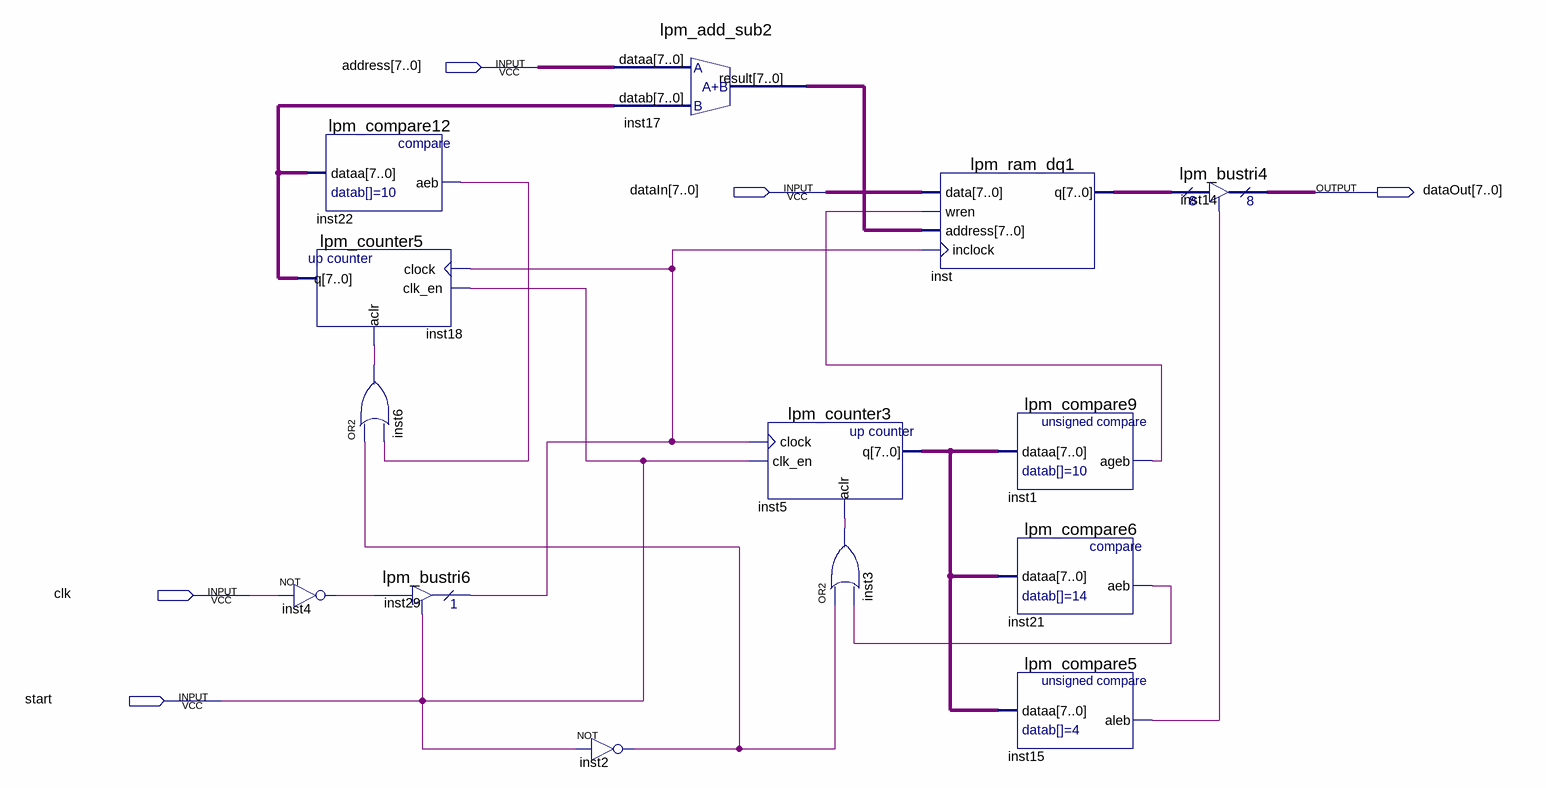
[diagram p0: schematic sheet]
// Quartus schematic RAM_block.bdf as structural Verilog: 14 symbols, 5 pins
module RAM_block (
  input  [7:0] address,
  input  [7:0] dataIn,
  input  clk,
  input  start,
  output [7:0] dataOut
);

  wire inst1_ageb, inst2_out, inst3_out, inst4_out, inst6_out, inst15_aleb, inst21_aeb, inst22_aeb,
       inst29_tridata;
  wire [7:0] inst5_q, inst17_result, inst18_q, inst_q;

  lpm_compare12 inst22 (.dataa(inst18_q), .aeb(inst22_aeb));
  lpm_counter5 inst18 (.clock(inst29_tridata), .clk_en(start), .aclr(inst6_out), .q(inst18_q));
  not inst4 (inst4_out, clk);
  or inst6 (inst6_out, inst2_out, inst22_aeb);
  lpm_bustri6 inst29 (.enabledt(start), .data(inst4_out), .tridata(inst29_tridata));
  lpm_add_sub2 inst17 (.dataa(address), .datab(inst18_q), .result(inst17_result));
  not inst2 (inst2_out, start);
  lpm_counter3 inst5 (.clock(inst29_tridata), .clk_en(start), .aclr(inst3_out), .q(inst5_q));
  or inst3 (inst3_out, inst2_out, inst21_aeb);
  lpm_ram_dq1 inst (.data(dataIn), .wren(inst1_ageb), .address(inst17_result), .inclock(inst29_tridata), .q(inst_q));
  lpm_compare9 inst1 (.dataa(inst5_q), .ageb(inst1_ageb));
  lpm_compare6 inst21 (.dataa(inst5_q), .aeb(inst21_aeb));
  lpm_compare5 inst15 (.dataa(inst5_q), .aleb(inst15_aleb));
  lpm_bustri4 inst14 (.enabledt(inst15_aleb), .data(inst_q), .tridata(dataOut));
endmodule
